# EAGLE design Motorcontroller (EAGLE 6.4)
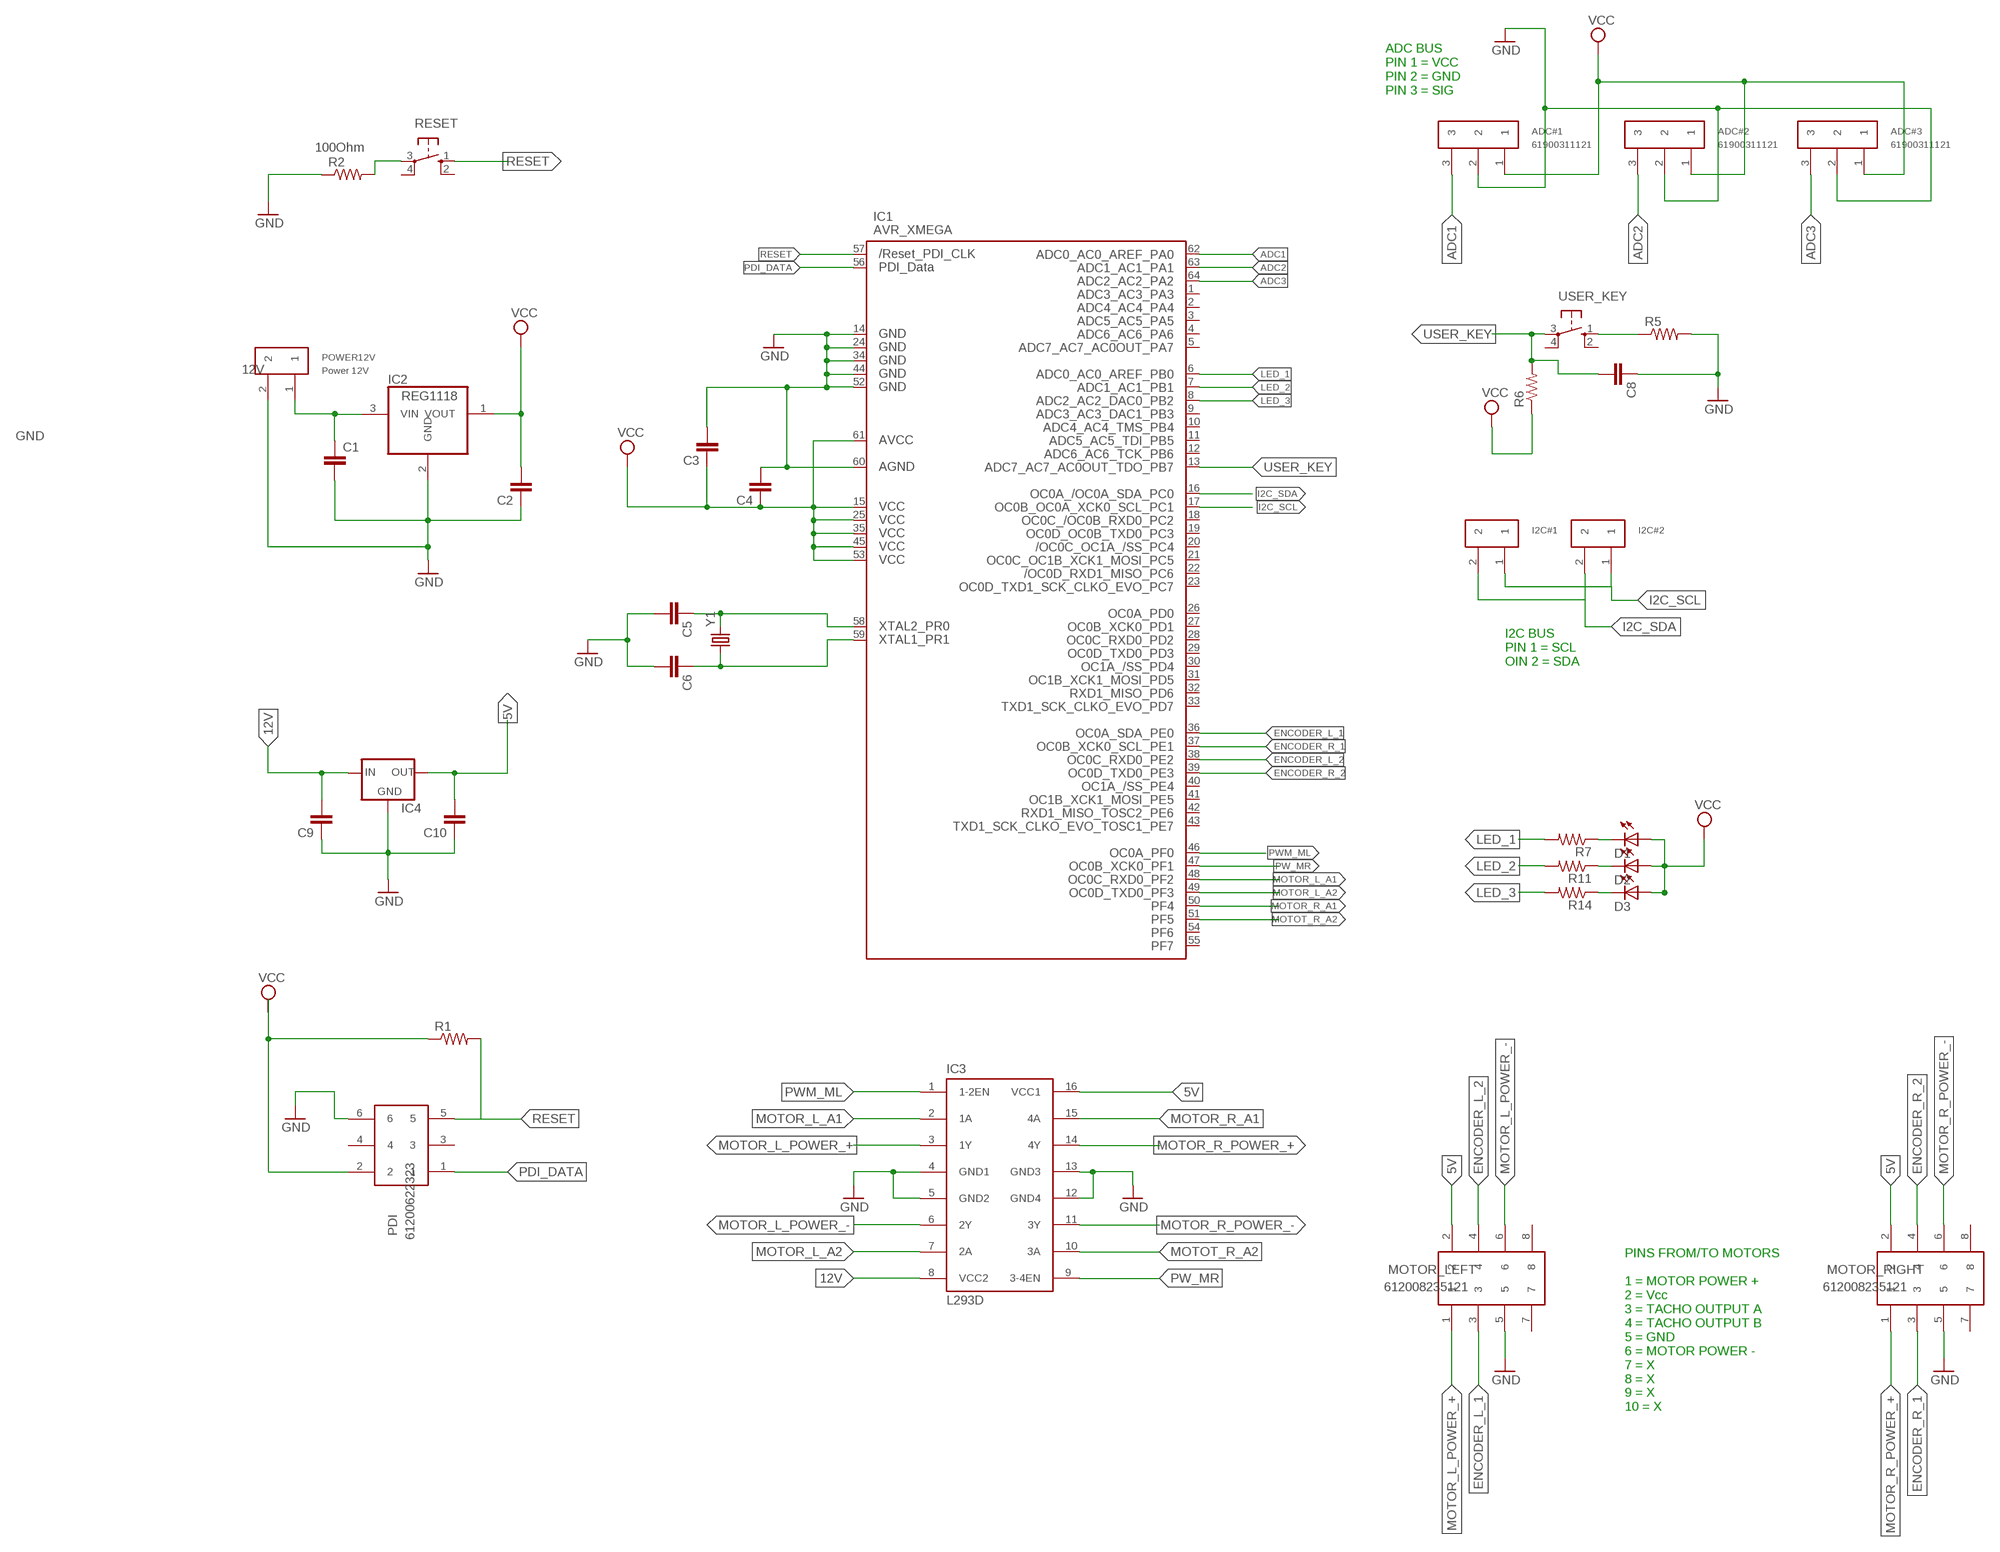
[diagram p0: schematic, sheet 1]

## Parts
ADC#1  61900311121  [61900311121]
ADC#2  61900311121  [61900311121]
ADC#3  61900311121  [61900311121]
C1  CAP1206  [1206]
C2  CAP1206  [1206]
C3  CAP1206  [1206]
C4  CAP1206  [1206]
C5  CAP1206  [1206]
C6  CAP1206  [1206]
C8  CAP1206  [1206]
C9  CAP1206  [1206]
C10  CAP1206  [1206]
D1  LEDSML0805  [SML0805]
D2  LEDSML0805  [SML0805]
D3  LEDSML0805  [SML0805]
I2C#1  61900211121  [61900211121]
I2C#2  61900211121  [61900211121]
IC1  AVR_XMEGA  AVR_XMEGA_A3_  [TQFP64]
IC2  REG1118  [SOT223]
IC3  L293D  [DIL16]
IC4  V_REG_78XX-TO-220  [TO-220-ALT]
MOTOR_LEFT  612008235121  [612008235121]
MOTOR_RIGHT  612008235121  [612008235121]
PDI  61200622323  [61200622323]
POWER12V  Power 12V  61900211121  [61900211121]
R1  RESISTOR1206  [1206]
R2  100Ohm  RESISTOR1206  [1206]
R5  RESISTOR1206  [1206]
R6  RESISTOR1206  [1206]
R7  RESISTOR1206  [1206]
R11  RESISTOR1206  [1206]
R14  RESISTOR1206  [1206]
RESET  10-XX  [B3F-10XX]
USER_KEY  10-XX  [B3F-10XX]
Y1  CRYSTALHC49US  [HC49US]

## Nets
5V: C10.2 IC3.16(VCC1) IC4.OUT MOTOR_LEFT.2 MOTOR_RIGHT.2
12V: C1.1 C9.2 IC2.3(VIN) IC3.8(VCC2) IC4.IN POWER12V.1
ADC1: ADC#1.3 IC1.62(PA0)
ADC2: ADC#2.3 IC1.63(PA1)
ADC3: ADC#3.3 IC1.64(PA2)
ENCODER_L_1: IC1.36(PE0) MOTOR_LEFT.3
ENCODER_L_2: IC1.38(PE2) MOTOR_LEFT.4
ENCODER_R_1: IC1.37(PE1) MOTOR_RIGHT.3
ENCODER_R_2: IC1.39(PE3) MOTOR_RIGHT.4
GND: ADC#1.2 ADC#2.2 ADC#3.2 C1.2 C2.1 C3.2 C4.2 C5.2 C6.2 C8.1 C9.1 C10.1 IC1.14(GND1) IC1.24(GND2) IC1.34(GND3) IC1.44(GND4) IC1.52(GND5) IC1.60(AGND) IC2.2(GND) IC3.4(GND1) IC3.5(GND2) IC3.12(GND4) IC3.13(GND3) IC4.GND MOTOR_LEFT.5 MOTOR_RIGHT.5 PDI.6 POWER12V.2 R2.1 R5.2
I2C_SCL: I2C#1.1 I2C#2.1 IC1.17(PC1)
I2C_SDA: I2C#1.2 I2C#2.2 IC1.16(PC0)
LED_1: IC1.6(PB0) R7.2
LED_2: IC1.7(PB1)
LED_3: IC1.8(PB2)
MOTOR_L_A1: IC1.48(PF2) IC3.2(1A)
MOTOR_L_A2: IC1.49(PF3) IC3.7(2A)
MOTOR_L_POWER_+: IC3.3(1Y) MOTOR_LEFT.1
MOTOR_L_POWER_-: IC3.6(2Y) MOTOR_LEFT.6
MOTOR_R_A1: IC1.50(PF4) IC3.15(4A)
MOTOR_R_POWER_+: IC3.14(4Y) MOTOR_RIGHT.1
MOTOR_R_POWER_-: IC3.11(3Y) MOTOR_RIGHT.6
MOTOT_R_A2: IC1.51(PF5) IC3.10(3A)
N$1: R11.2
N$2: R14.2
N$5: C5.1 IC1.58(PR0) Y1.2
N$6: C6.1 IC1.59(PR1) Y1.1
N$8: R2.2 RESET.3(P)
N$30: R5.1 USER_KEY.1(S)
N$31: D1.C R7.1
N$42: D2.C R11.1
N$43: D3.C R14.1
PDI_DATA: IC1.56(PDI_DATA) PDI.1
PW_MR: IC1.47(PF1) IC3.9(3-4EN)
PWM_ML: IC1.46(PF0) IC3.1(1-2EN)
RESET: IC1.57(RESET) PDI.5 R1.2 RESET.1(S)
USER_KEY: C8.2 IC1.13(PB7) R6.2 USER_KEY.3(P)
VCC: ADC#1.1 ADC#2.1 ADC#3.1 C2.2 C3.1 C4.1 D1.A D2.A D3.A IC1.15(VCC1) IC1.25(VCC2) IC1.35(VCC3) IC1.45(VCC4) IC1.53(VCC5) IC1.61(AVCC) IC2.1(VOUT) PDI.2 R1.1 R6.1
Unconnected: IC1.1(PA3) IC1.2(PA4) IC1.3(PA5) IC1.4(PA6) IC1.5(PA7) IC1.9(PB3) IC1.10(PB4) IC1.11(PB5) IC1.12(PB6) IC1.18(PC2) IC1.19(PC3) IC1.20(PC4) IC1.21(PC5) IC1.22(PC6) IC1.23(PC7) IC1.26(PD0) IC1.27(PD1) IC1.28(PD2) IC1.29(PD3) IC1.30(PD4) IC1.31(PD5) IC1.32(PD6) IC1.33(PD7) IC1.40(PE4) IC1.41(PE5) IC1.42(PE6) IC1.43(PE7) IC1.54(PF6) IC1.55(PF7) MOTOR_LEFT.7 MOTOR_LEFT.8 MOTOR_RIGHT.7 MOTOR_RIGHT.8 PDI.3 PDI.4 RESET.2(S1) RESET.4(P1) USER_KEY.2(S1) USER_KEY.4(P1)

## Notes on the sheet
- ADC BUS
  PIN 1 = VCC
  PIN 2 = GND
  PIN 3 = SIG
- I2C BUS
  PIN 1 = SCL
  OIN 2 = SDA
- PINS FROM/TO MOTORS
  
  1 = MOTOR POWER +
  2 = Vcc
  3 = TACHO OUTPUT A
  4 = TACHO OUTPUT B
  5 = GND
  6 = MOTOR POWER -
  7 = X
  8 = X
  9 = X
  10 = X

## Library data of the parts
ADC#1-ADC#3 = Wuerth_Elektronik_eiCan_09_Wire_to_Board_Connectors:61900311121: WR-WTB 2.54mm Male Locking Header, 3 Pins
C1-C6 C8-C10 = SparkFun-Capacitors:CAP: Capacitor Standard 0603 ceramic capacitor, and 0.1" leaded capacitor.
D1-D3 = led:LED: LED OSRAM: - CHIPLED LG R971, LG N971, LY N971, LG Q971, LY Q971, LO R971, LY R971 LH N974, LH R974 LS Q976, LO Q976, LY Q976 LO Q996 - Hyper CHIPLED LW Q18S LB Q993, LB Q99A, LB R99A - SideLED LS A670, LO A670, LY A670, LG A670, LP A670 LB A673, LV A673, LT A673, LW A673 LH A674 LY A675 LS A676, LA A676, LO A676, LY A676, LW A676 LS A679, LY A679, LG A679 - Hyper Micro SIDELED® LS Y876, LA Y876, LO Y876, LY Y876 LT Y87S - SmartLED LW L88C, LW L88S LB L89C, LB L89S, LG L890 LS L89K, LO L89K, LY L89K LS L896, LA L896, LO L896, LY L896 - TOPLED LS T670, LO T670, LY T670, LG T670, LP T670 LSG T670, LSP T670, LSY T670, LOP T670, LYG T670 LG T671, LOG T671, LSG T671 LB T673, LV T673, LT T673, LW T673 LH T674 LS T676, LA T676, LO T676, LY T676, LB T676, LH T676, LSB T676, LW T676 LB T67C, LV T67C, LT T67C, LS T67K, LO T67K, LY T67K, LW E67C LS E67B, LA E67B, LO E67B, LY E67B, LB E67C, LV E67C, LT E67C LW T67C LS T679, LY T679, LG T679 LS T770, LO T770, LY T770, LG T770, LP T770 LB T773, LV T773, LT T773, LW T773 LH T774 LS E675, LA E675, LY E675, LS T675 LS T776, LA T776, LO T776, LY T776, LB T776 LHGB T686 LT T68C, LB T68C - Hyper Mini TOPLED® LB M676 - Mini TOPLED Santana® LG M470 LS M47K, LO M47K, LY M47K Source: http://www.osram.convergy.de LUXEON: - LUMILED® LXK2-PW12-R00, LXK2-PW12-S00, LXK2-PW14-U00, LXK2-PW14-V00 LXK2-PM12-R00, LXK2-PM12-S00, LXK2-PM14-U00 LXK2-PE12-Q00, LXK2-PE12-R00, LXK2-PE12-S00, LXK2-PE14-T00, LXK2-PE14-U00 LXK2-PB12-K00, LXK2-PB12-L00, LXK2-PB12-M00, LXK2-PB14-N00, LXK2-PB14-P00, LXK2-PB14-Q00 LXK2-PR12-L00, LXK2-PR12-M00, LXK2-PR14-Q00, LXK2-PR14-R00 LXK2-PD12-Q00, LXK2-PD12-R00, LXK2-PD12-S00 LXK2-PH12-R00, LXK2-PH12-S00 LXK2-PL12-P00, LXK2-PL12-Q00, LXK2-PL12-R00 Source: www.luxeon.com KINGBRIGHT: KA-3528ASYC Source: www.kingbright.com
I2C#1 I2C#2 POWER12V = Wuerth_Elektronik_eiCan_09_Wire_to_Board_Connectors:61900211121: WR-WTB 2.54mm Male Locking Header, 2 Pins
IC1 = ieee-ucsd-lbr_xmega:AVR_XMEGA_A3_: Device for Atmel AVR XMEGA A3 Series
IC2 = burr-brown:REG1118: 800mA Low Dropout (LDO) Positive Regulator with Current Source and Sink Capability; MPN: REG1118-2.85/2K5G4; OC_FARNELL: unknown; OC_NEWARK: 14M2185
IC3 = st-microelectronics:L293D: PUSH-PULL 4 CHANNEL DRIVER; MPN: L293D; OC_FARNELL: 9589619; OC_NEWARK: 56P8249
IC4 = SparkFun-PowerIC:V_REG_78XX: Voltage Regulator Standard 7805 5V regulator. IGO (Input Ground Output). Spark Fun Electronics SKU : COM-00107
MOTOR_LEFT MOTOR_RIGHT = Wuerth_Elektronik_eiCan_05_Box_Header_IDC_Connectors_1_2:612008235121: WR-BHD 2.54mm Male Box Header High Temperature, 8 Pins
PDI = Wuerth_Elektronik_eiCan_05_Box_Header_IDC_Connectors_1_2:61200622323: WR-BHD 2.54mm Board to Cable Transition Connector, 6 Pins
R1 = SparkFun-Passives:RESISTOR: Resistor Basic schematic elements and footprints for 0603, 1206, and PTH resistors.
R2 R5-R7 R11 R14 = SparkFun-Resistors:RESISTOR: Resistor Basic schematic elements and footprints for 0603, 1206, and PTH resistors.
RESET USER_KEY = switch-omron:10-XX: OMRON SWITCH; MPN: B3F-1000; OC_FARNELL: 176432; OC_NEWARK: 36M3542
Y1 = SparkFun-FreqCtrl:CRYSTAL: Various standard crystals. Proven footprints. Spark Fun Electronics SKU : COM-00534

## Board
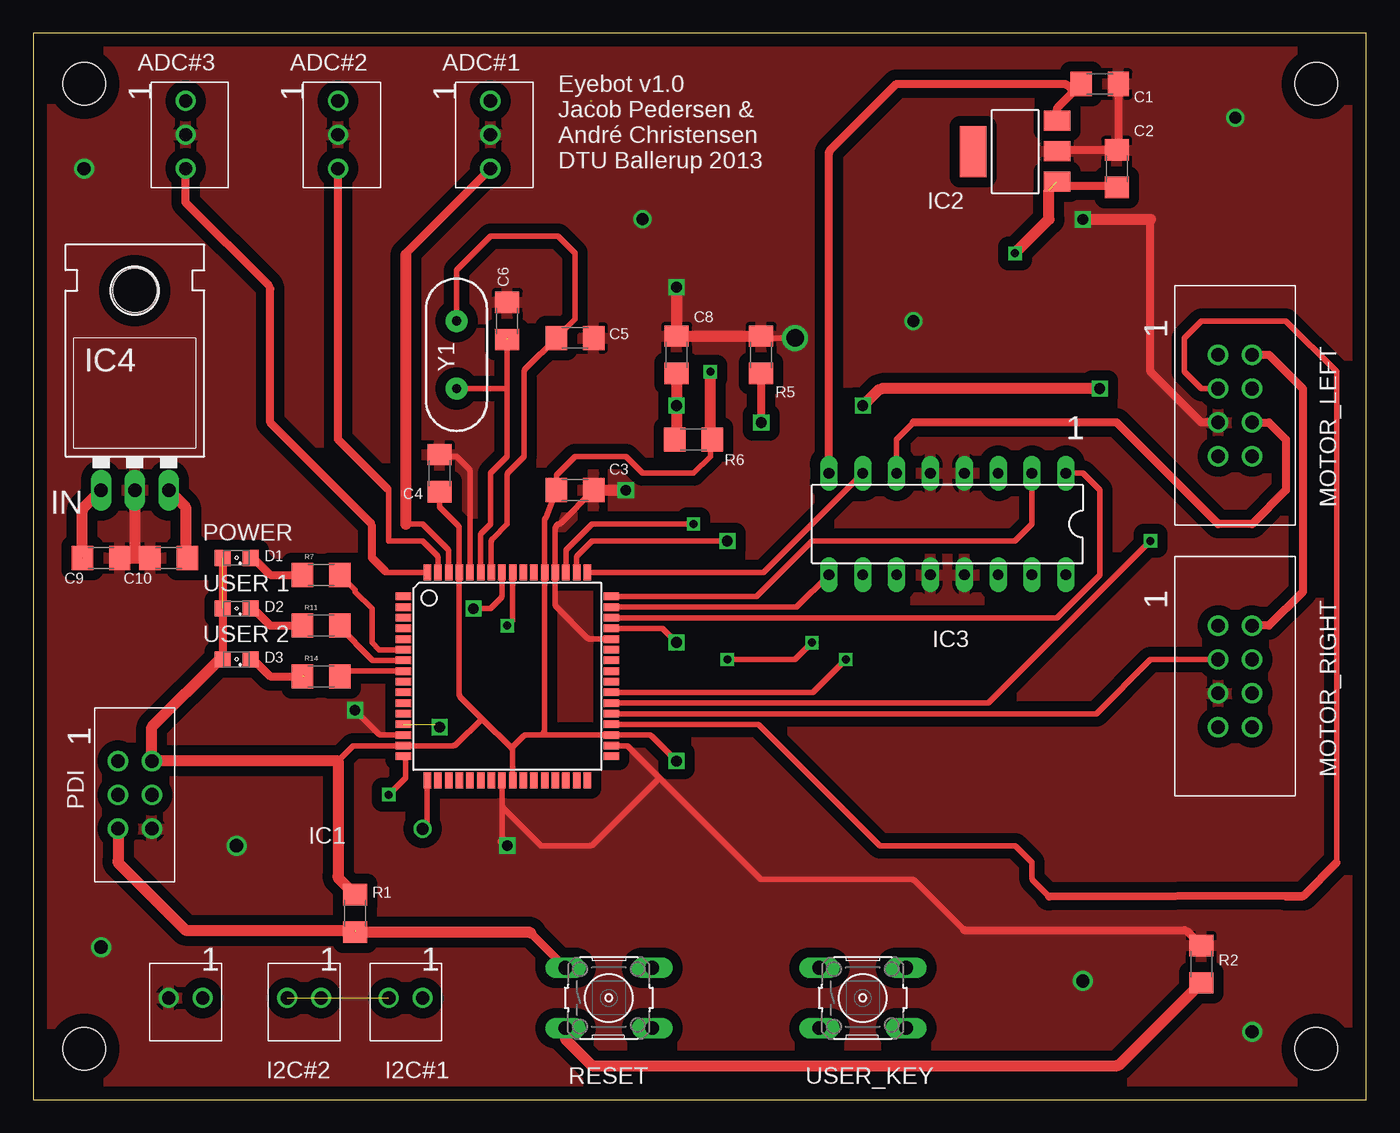
[diagram p1: board, top side]
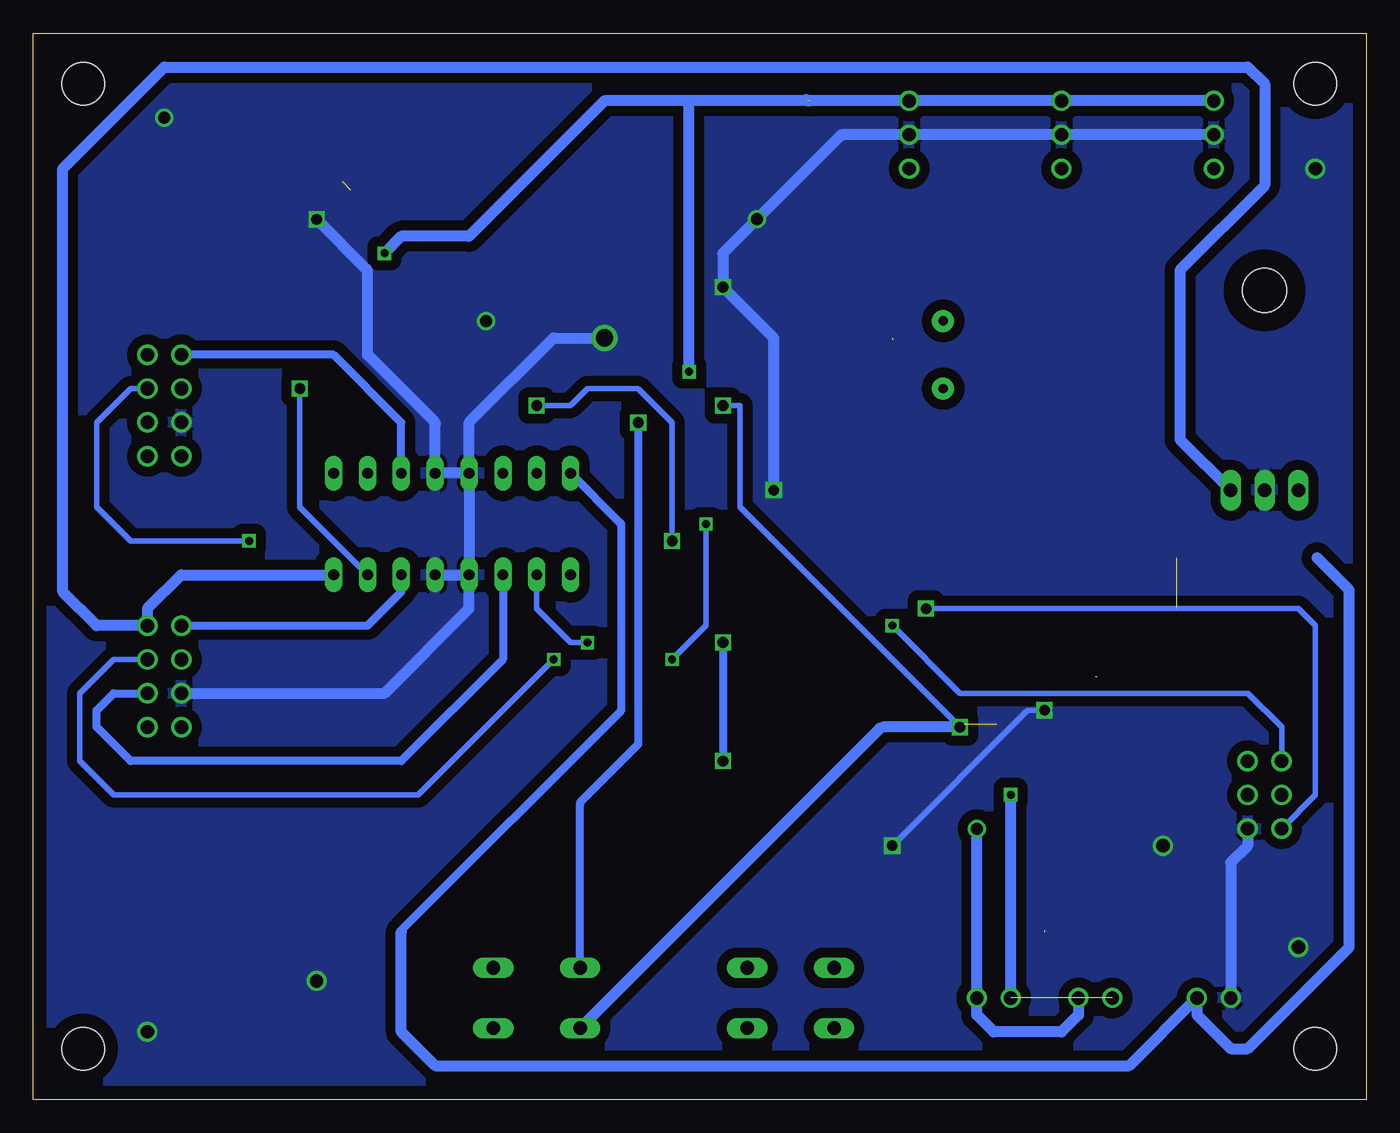
[diagram p2: board, bottom side, seen from below]

Size 100 x 80 mm. Coordinates in mm from the lower left corner, seen from the top.
Outline: 0,0 100,0 100,80 0,80 0,0
Copper layers (1*16): Top 0.035mm / dielectric 1.5mm / Bottom 0.035mm
Design rules "andre": minimum track width 12mil, minimum drill 24mil, track to track 30mil, track to pad 18mil, pad to pad 18mil, via to via 18mil, smd to smd 50mil, copper to edge 40mil, drill to drill 8mil, minimum pad ring 10mil, minimum via ring 8mil, stop-mask expansion 4mil, vias tented up to drill 0mil, thermal gap 10mil
Holes 3.2 mm at 3.81,3.81 96.27,3.81 3.81,76.2 96.27,76.2

### Footprints (pad centres in the part's own frame; a part is rotated, then mirrored left to right if it is on the bottom)
61900311121 = drill 1: 1 1.27,0; 2 -1.27,0; 3 -3.81,0
1206 = smd 1.6 x 1.8: 1 -1.4,0; 2 1.4,0
SML0805 = smd 1.2 x 1.2: A 1.05,0; C -1.05,0
61900211121 = drill 1: 1 1.27,0; 2 -1.27,0
TQFP64 = smd 1.194 x 0.559: 1 -7.8,6; 2 -7.8,5.2; 3 -7.8,4.4; 4 -7.8,3.6; 5 -7.8,2.8; 6 -7.8,2; 7 -7.8,1.2; 8 -7.8,0.4; 9 -7.8,-0.4; 10 -7.8,-1.2; 11 -7.8,-2; 12 -7.8,-2.8; 13 -7.8,-3.6; 14 -7.8,-4.4; 15 -7.8,-5.2; 16 -7.8,-6; 33 7.8,-6; 34 7.8,-5.2; 35 7.8,-4.4; 36 7.8,-3.6; 37 7.8,-2.8; 38 7.8,-2; 39 7.8,-1.2; 40 7.8,-0.4; 41 7.8,0.4; 42 7.8,1.2; 43 7.8,2; 44 7.8,2.8; 45 7.8,3.6; 46 7.8,4.4; 47 7.8,5.2; 48 7.8,6 | smd 0.559 x 1.194: 17 -6,-7.8; 18 -5.2,-7.8; 19 -4.4,-7.8; 20 -3.6,-7.8; 21 -2.8,-7.8; 22 -2,-7.8; 23 -1.2,-7.8; 24 -0.4,-7.8; 25 0.4,-7.8; 26 1.2,-7.8; 27 2,-7.8; 28 2.8,-7.8; 29 3.6,-7.8; 30 4.4,-7.8; 31 5.2,-7.8; 32 6,-7.8; 49 6,7.8; 50 5.2,7.8; 51 4.4,7.8; 52 3.6,7.8; 53 2.8,7.8; 54 2,7.8; 55 1.2,7.8; 56 0.4,7.8; 57 -0.4,7.8; 58 -1.2,7.8; 59 -2,7.8; 60 -2.8,7.8; 61 -3.6,7.8; 62 -4.4,7.8; 63 -5.2,7.8; 64 -6,7.8
SOT223 = smd 1.499 x 2.007: 1 -2.261,-3.15; 2 0.025,-3.15; 3 2.311,-3.15 | smd 3.81 x 2.007: 4 0,3.15
DIL16 = drill 0.813 long: 1 -8.89,-3.81; 2 -6.35,-3.81; 3 -3.81,-3.81; 4 -1.27,-3.81; 5 1.27,-3.81; 6 3.81,-3.81; 7 6.35,-3.81; 8 8.89,-3.81; 9 8.89,3.81; 10 6.35,3.81; 11 3.81,3.81; 12 1.27,3.81; 13 -1.27,3.81; 14 -3.81,3.81; 15 -6.35,3.81; 16 -8.89,3.81
TO-220-ALT = drill 1.016 long: GND 0,-3.81; IN -2.54,-3.81; OUT 2.54,-3.81 | hole 3.302: 0,11.176
612008235121 = drill 1.02: 1 -2.54,-1.27; 2 -2.54,1.27; 3 0,-1.27; 4 0,1.27; 5 2.54,-1.27; 6 2.54,1.27; 7 5.08,-1.27; 8 5.08,1.27
61200622323 = drill 1.02: 1 -2.54,-1.27; 2 -2.54,1.27; 3 0,-1.27; 4 0,1.27; 5 2.54,-1.27; 6 2.54,1.27
B3F-10XX = drill 1.016 long: 1 -3.251,2.261; 2 3.251,2.261; 3 -3.251,-2.261; 4 3.251,-2.261
HC49US = drill 0.7 pad 1.651: 1 -2.54,0; 2 2.54,0

### Placement (x,y rotation side)
ADC#1  34.29,73.66 90 top
ADC#2  22.86,73.66 90 top
ADC#3  11.43,73.66 90 top
C1  80.01,76.2 0 top
C2  81.28,69.85 270 top
C3  40.64,45.72 0 top
C4  30.48,46.99 90 top
C5  40.64,57.15 0 top
C6  35.56,58.42 90 top
C8  48.26,55.88 270 top
C9  5.08,40.64 180 top
C10  10.16,40.64 0 top
D1  15.24,40.64 180 top
D2  15.24,36.83 180 top
D3  15.24,33.02 180 top
I2C#1  27.94,7.62 0 top
I2C#2  20.32,7.62 0 top
IC1  35.56,31.75 0 top
IC2  73.66,71.12 90 top
IC3  68.58,43.18 180 top
IC4  7.62,49.53 0 top
MOTOR_LEFT  90.17,53.34 270 top
MOTOR_RIGHT  90.17,33.02 270 top
PDI  7.62,22.86 270 top
POWER12V  11.43,7.62 0 top
R1  24.13,13.97 270 top
R2  87.63,10.16 270 top
R5  54.61,55.88 90 top
R6  49.53,49.53 180 top
R7  21.59,39.37 0 top
R11  21.59,35.56 0 top
R14  21.59,31.75 0 top
RESET  43.18,7.62 0 top
U$3  [LOGO2]  35.56,2.54 0 top
USER_KEY  62.23,7.62 0 top
Y1  31.75,55.88 90 top

### Tracks (layer width: path | path; a pad name or v marks a point on that pad's centre or on a via)
5V
  Top 0.61: MOTOR_LEFT.2 92.71,55.88 95.25,53.34 95.25,38.1 92.71,35.56 MOTOR_RIGHT.2
  Top 0.813: IC4.OUT 11.43,44.45 11.43,40.9 arc45 11.52,40.68 C10.2
  Bottom 0.813: IC4.OUT 13.97,49.53 13.97,62.23 7.62,68.58 7.62,76.2 8.89,77.47 90.17,77.47 97.79,69.85 97.79,38.1 95.25,35.56 MOTOR_RIGHT.2 91.44,36.83 88.9,39.37 IC3.16
12V  (1 unrouted)
  Top 0.61: IC2.3 76.81,74.27 arc-45 76.9,74.49 78.04,75.63 | 78.04,75.63 C1.1 | IC3.8 59.69,70.99 arc-45 59.78,71.21 64.77,76.2 77.34,76.2 arc-45 77.56,76.11 78.04,75.63
  Top 0.813: C9.2 3.68,44.19 arc-45 3.77,44.41 IC4.IN
  Bottom 0.61: 72.39,12.57 arc45 72.3,12.79 55.88,29.21 55.88,43.05 arc-45 55.97,43.27 IC3.8
  Bottom 0.813: 72.39,12.57 72.39,5.08 69.85,2.54 17.78,2.54 POWER12V.1 12.7,6.35 10.16,3.81 8.89,3.81 1.27,11.43 1.27,38.23 C9.2
ADC1
  Top 0.406: 27.94,43.18 29.21,43.18 31.07,41.32 arc-45 31.16,41.1 IC1.62 | 27.94,63.37 arc-45 28.03,63.59
  Top 0.61: 28.03,63.59 ADC#1.3
  Top 0.813: 27.94,63.37 27.94,43.18
ADC2
  Top 0.406: 26.58,45.81 arc-45 26.67,45.59 26.67,41.91 29.21,41.91 30.27,40.85 arc-45 30.36,40.63 IC1.63
  Top 0.61: 26.58,45.81 22.86,49.53 ADC#2.3
ADC3
  Top 0.406: 26.4,39.64 arc45 26.62,39.55 IC1.64 | 25.4,43.05 arc45 25.31,43.27 | 17.78,60.83 arc45 17.69,61.05
  Top 0.61: 26.4,39.64 25.4,40.64 25.4,43.05 | 25.31,43.27 17.78,50.8 17.78,60.83 | 17.69,61.05 11.43,67.31 ADC#3.3
ENCODER_L_1
  Top 0.406: 76.2,15.24 75.02,16.42 arc-45 74.93,16.64 74.93,17.78 73.75,18.96 arc45 73.53,19.05 63.5,19.05 54.49,28.06 arc45 54.27,28.15 IC1.36 | 97.79,17.78 97.79,54.61 93.98,58.42 87.63,58.42 86.36,57.15 86.36,54.61 87.63,53.34 MOTOR_LEFT.3
  Top 0.61: 93.98,15.24 95.12,15.24 arc45 95.34,15.33 | 95.34,15.33 97.79,17.78 | 76.2,15.24 95.34,15.33
ENCODER_L_2  (via drill 0.6)
  Top 0.406: IC1.38 71.66,29.75 v83.82,41.91
  Bottom 0.406: v83.82,41.91 92.71,41.91 95.25,44.45 95.25,50.8 92.71,53.34 MOTOR_LEFT.4
ENCODER_R_1
  Top 0.406: IC1.37 79.75,28.95 83.82,33.02 MOTOR_RIGHT.3
ENCODER_R_2  (via drill 0.6)
  Top 0.406: IC1.39 58.49,30.55 v60.96,33.02
  Bottom 0.406: v60.96,33.02 71.12,22.86 93.98,22.86 96.52,25.4 96.52,30.48 93.98,33.02 MOTOR_RIGHT.4
GND  (via drill 0.8, 0.9, 1, 1.3 pad 0.81)
  Top 0.406: C3.2 39.59,43.27 arc-45 39.37,43.18 39.25,43.06 arc45 39.16,42.84 IC1.52 39.16,37.17 arc45 39.25,36.95 41.56,34.64 arc45 41.78,34.55 IC1.44 | IC1.34 44.44,26.55 arc-45 44.66,26.46 46.99,24.13 | 46.99,24.13 54.61,16.51 65.91,16.51 arc-45 66.13,16.42 69.85,12.7 | 86.36,12.7 arc-45 86.58,12.61 | 35.25,19.36 arc-45 35.16,19.58 IC1.24 35.16,22.12 arc45 35.25,21.9 38.1,19.05 41.78,19.05 arc45 42,19.14 46.99,24.13 | IC1.14 26.12,27.35 arc-45 25.9,27.44 v24.13,29.21 | v57.15,57.15 54.87,57.15 arc-45 54.65,57.24 R5.2 | IC1.60 32.76,47.12 arc45 32.67,47.34 31.75,48.26 30.74,48.26 arc-45 30.52,48.35 C4.2
  Top 0.61: MOTOR_LEFT.5 87.76,50.8 arc-45 87.54,50.89 83.82,54.61 83.82,66.04 | C1.2 81.41,71.51 arc-45 81.32,71.29 C2.1 77.05,71.25 arc45 IC2.2 | 69.85,12.7 86.36,12.7 | 86.58,12.61 R2.1
  Top 0.813: 6.35,40.64 C9.1 7.62,40.64 | 7.62,40.64 C10.1 | IC4.GND 7.62,40.64 | C3.2 v44.45,45.72 | v48.26,60.96 C8.1 R5.2 | v78.74,66.04 83.82,66.04 | 57.11,57.19 v57.15,57.15 | 35.25,19.36 v35.56,19.05
  Bottom 0.406: v24.13,29.21 25.27,29.21 arc-45 25.49,29.12 v35.56,19.05
  Bottom 0.813: ADC#3.2 ADC#2.2 ADC#1.2 39.24,72.39 arc-45 39.46,72.3 v45.72,66.04 48.26,63.5 v48.26,60.96 44.54,57.24 arc45 44.45,57.02 v44.45,45.72 | IC3.5 IC3.4 69.85,50.67 arc-45 69.94,50.89 74.93,55.88 74.93,62.1 arc-45 75.02,62.32 v78.74,66.04 | IC3.5 67.31,50.67 arc45 67.22,50.89 60.96,57.15 v57.15,57.15 | IC3.5 IC3.12 | IC3.13 IC3.12 | PDI.6 8.89,19.05 10.16,17.78 POWER12V.2 | MOTOR_RIGHT.5 73.66,30.48 67.31,36.83 IC3.12
  other vias: 15.24,19.05 5.08,11.43 78.74,8.89 91.44,5.08 3.81,69.85 90.17,73.66 66.04,58.42
  pour Top: 0,80.01 100.33,80.01 100.33,0 0,0
  pour Bottom: 0,80.01 100.33,80.01 100.33,0 0,0
I2C_SCL  (via drill 0.9)
  Top 0.406: IC1.17 29.56,20.67 v29.21,20.32
  Bottom 0.813: v29.21,20.32 I2C#1.1 29.21,6.35 27.94,5.08 22.86,5.08 21.59,6.35 I2C#2.1
I2C_SDA  (via drill 0.6)  (1 unrouted)
  Top 0.406: v26.67,22.86 27.94,24.13 27.94,25.57 IC1.16
  Bottom 0.813: I2C#1.2 v26.67,22.86
LED_1
  Top 0.406: IC1.6 25.94,33.75 25.4,34.29 25.4,36.83 24.13,38.1 24.13,38.23 R7.2
LED_2
  Top 0.406: IC1.7 25.47,32.95 22.86,35.56
LED_3
  Top 0.406: IC1.8 22.99,32.15
MOTOR_L_A1
  Top 0.406: IC1.48 54.26,37.75 58.42,41.91 73.66,41.91 74.93,43.18 IC3.2
MOTOR_L_A2
  Top 0.406: IC1.49 54.79,39.55 IC3.7
MOTOR_L_POWER_+
  Bottom 0.61: IC3.3 72.39,50.8 77.47,55.88 MOTOR_LEFT.1
MOTOR_L_POWER_-
  Top 0.406: IC3.6 64.77,49.53 66.04,50.8
  Top 0.61: MOTOR_LEFT.6 92.71,50.8 93.98,49.53 93.98,45.72 91.44,43.18 88.9,43.18 81.28,50.8 66.04,50.8
MOTOR_R_A1  (via drill 0.8)
  Top 0.406: 63.63,53.34 arc45 63.41,53.25 | v52.07,41.91 41.91,41.91 40.85,40.85 arc45 40.76,40.63 IC1.50
  Top 0.813: v80.01,53.34 63.63,53.34 | 63.41,53.25 v62.23,52.07
  Bottom 0.406: IC3.15 80.01,44.45 v80.01,53.34 | v62.23,52.07 59.82,52.07 arc-45 59.6,52.16 58.42,53.34 54.74,53.34 arc45 54.52,53.25 52.07,50.8 v52.07,41.91
MOTOR_R_POWER_+
  Bottom 0.61: MOTOR_RIGHT.1 74.93,35.56 72.39,38.1 IC3.14
MOTOR_R_POWER_-
  Bottom 0.61: IC3.11 64.77,33.02 72.39,25.4 92.71,25.4 95.25,27.94 95.25,29.21 93.98,30.48 MOTOR_RIGHT.6
MOTOT_R_A2  (via drill 0.6)
  Top 0.406: IC1.51 39.96,41.23 41.91,43.18 v49.53,43.18 | v52.07,33.02 57.15,33.02 v58.42,34.29
  Bottom 0.406: v49.53,43.18 49.53,35.56 v52.07,33.02 | v58.42,34.29 59.69,34.29 62.23,36.83 IC3.10
N$5
  Top 0.406: IC1.58 34.36,41.85 arc-45 34.45,42.07 35.56,43.18 35.56,46.86 arc-45 35.65,47.08 36.83,48.26 36.83,54.61 arc-45 36.92,54.83 C5.1 40.64,58.55 40.64,63.5 39.37,64.77 34.29,64.77 31.75,62.23 Y1.2
N$6  (1 unrouted)
  Top 0.406: IC1.59 33.56,42.32 arc-45 33.65,42.54 34.29,43.18 34.29,46.99 35.56,48.26 35.56,53.34 | 35.56,53.34 35.56,57.15 arc-45 35.65,57.37 | Y1.1 35.56,53.34
N$8
  Top 0.813: RESET.3 39.93,4.65 arc45 40.02,4.43 41.91,2.54 81.28,2.54 arc45 81.5,2.63 R2.2
N$30  (via drill 0.8)
  Top 0.61: R5.1 v54.61,50.8
  Bottom 0.61: USER_KEY.1 58.98,22.17 arc45 58.89,22.39 54.61,26.67 v54.61,50.8
N$31
  Top 0.61: D1.C 16.51,40.64 17.78,39.37 R7.1
N$42
  Top 0.61: D2.C 16.51,36.83 17.78,35.56 R11.1
N$43  (1 unrouted)
  Top 0.61: D3.C 16.51,33.02 17.78,31.75 20.32,31.75
PDI_DATA  (via drill 0.6)
  Top 0.406: IC1.56 35.96,35.96 v35.56,35.56
  Bottom 0.406: PDI.1 6.35,27.94 8.89,30.48 30.48,30.48 v35.56,35.56
PW_MR
  Top 0.406: IC1.47 57.27,36.95 IC3.9
PWM_ML
  Top 0.406: IC1.46 76.79,36.15 80.01,39.37 80.01,45.72 78.74,46.99 IC3.1
RESET  (via drill 0.8)  (1 unrouted)
  Top 0.406: v33.02,36.83 34.29,36.83 35.07,37.61 arc45 35.16,37.83 IC1.57
  Top 0.61: RESET.1 37.33,12.48
  Top 0.813: PDI.5 6.35,17.91 arc45 6.44,17.69 11.43,12.7 24.13,12.7 | R1.2 37.11,12.57 arc-45 37.33,12.48
  Bottom 0.406: v33.02,36.83 5.08,36.83 3.81,35.56 3.81,22.86 PDI.5
USER_KEY  (via drill 0.8)  (1 unrouted)
  Top 0.406: 30.14,28.15 arc-45 30.36,28.06 v30.48,27.94
  Top 0.813: C8.2 v48.26,52.07 48.26,49.79 arc-45 48.17,49.57 R6.2
  Bottom 0.406: v30.48,27.94 46.99,44.45 46.99,52.07 v48.26,52.07 | 36.27,27.94 arc-45 36.49,27.85
  Bottom 0.813: v30.48,27.94 36.27,27.94 | 36.49,27.85 USER_KEY.3
VCC  (via drill 0.6, 0.8)  (3 unrouted)
  Top 0.406: 22.86,25.4 23.92,26.46 arc-45 24.14,26.55 IC1.15 31.5,26.55 arc45 31.72,26.64 33.66,28.57 | v48.26,25.4 46.4,27.26 arc45 46.18,27.35 IC1.35 38.1,27.35 | C4.1 30.48,44.45 31.87,43.06 arc-45 31.96,42.84 IC1.61 31.96,30.4 arc45 32.05,30.18 33.66,28.57 | 33.66,28.57 35.87,26.36 | IC1.25 35.96,26.14 arc45 35.87,26.36 | 38.1,27.35 36.99,27.35 arc45 36.76,27.26 35.87,26.36 | 38.1,27.35 38.27,27.52 arc45 38.36,27.74 IC1.53 38.36,43.44 arc-45 38.45,43.66 C3.1 39.24,46.86 40.64,48.26 44.45,48.26 45.72,46.99 49.53,46.99 50.8,48.26 50.8,49.4 R6.1 | IC1.45 47.2,35.35 v48.26,34.29
  Top 0.61: D1.A D3.A | IC2.1 77.06,68.86 arc-45 77.28,68.77 77.47,68.58 81.02,68.58 arc-45 81.24,68.49 C2.2
  Top 0.813: R1.1 22.95,16.55 arc-45 22.86,16.77 22.86,25.4 PDI.2 8.89,27.94 13.97,33.02 D3.A | v73.66,63.5 76.2,66.04 76.2,68.25 | R6.1 50.8,49.53 v50.8,54.61
  Bottom 0.61: v48.26,34.29 v48.26,25.4
  Bottom 0.813: ADC#3.1 ADC#2.1 ADC#1.1 41.78,74.93 arc45 42,75.02 | 41.91,74.93 50.8,74.93 | 50.8,74.93 57.15,74.93 67.31,64.77 72.39,64.77 v73.66,63.5 | v50.8,54.61 50.8,74.93

### Text on the board
tNames: 1 | 1 | 1 | Eyebot v1.0 / Jacob Pedersen & / André Christensen / DTU Ballerup 2013 | 1 | 1 | IN | POWER | USER 1 | 1 | USER 2 | 1 | 1 | 1 | 1